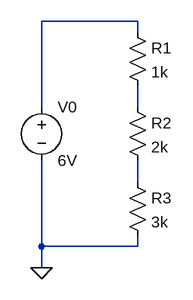
[diagram p0: schematic Draft1.asc]
Draft1.asc, the LTspice schematic file:
Version 4
SHEET 1 880 680
WIRE 144 48 0 48
WIRE 144 64 144 48
WIRE 0 176 0 48
WIRE 144 176 144 144
WIRE 144 288 144 256
WIRE 0 384 0 256
WIRE 144 384 144 368
WIRE 144 384 0 384
WIRE 0 416 0 384
FLAG 0 416 0
SYMBOL res 128 48 R0
SYMATTR InstName R1
SYMATTR Value 1k
SYMBOL res 128 160 R0
SYMATTR InstName R2
SYMATTR Value 2k
SYMBOL res 128 272 R0
SYMATTR InstName R3
SYMATTR Value 3k
SYMBOL voltage 0 160 R0
WINDOW 123 0 0 Left 0
WINDOW 39 0 0 Left 0
SYMATTR InstName V0
SYMATTR Value 6V

The netlist it stands for:
* Draft1.asc
R1 N001 N002 1k
R2 N002 N003 2k
R3 N003 0 3k
V0 N001 0 6V
.backanno
.end